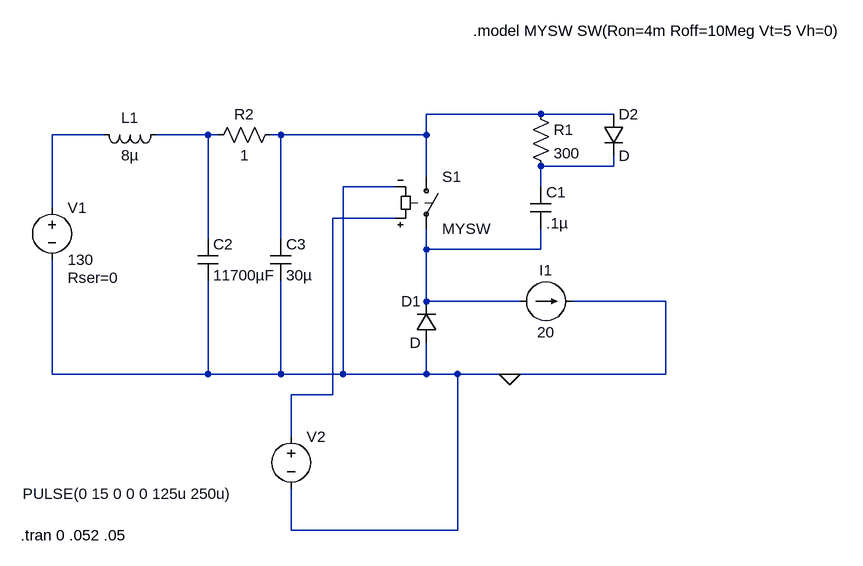
[diagram p0: schematic bus_cap.asc]
bus_cap.asc, the LTspice schematic file:
Version 4
SHEET 1 988 680
WIRE 416 -32 240 -32
WIRE 528 -32 416 -32
WIRE -256 0 -336 0
WIRE -96 0 -176 0
WIRE -80 0 -96 0
WIRE 16 0 0 0
WIRE 240 0 240 -32
WIRE 240 0 16 0
WIRE 528 48 528 32
WIRE 528 48 416 48
WIRE 240 64 240 0
WIRE 192 80 112 80
WIRE 416 80 416 48
WIRE -336 112 -336 0
WIRE 192 128 96 128
WIRE -96 160 -96 0
WIRE 16 160 16 0
WIRE 240 176 240 144
WIRE 416 176 416 144
WIRE 416 176 240 176
WIRE 240 256 240 176
WIRE 384 256 240 256
WIRE 608 256 464 256
WIRE -336 368 -336 192
WIRE -96 368 -96 224
WIRE -96 368 -336 368
WIRE 16 368 16 224
WIRE 16 368 -96 368
WIRE 112 368 112 80
WIRE 112 368 16 368
WIRE 240 368 240 320
WIRE 240 368 112 368
WIRE 288 368 240 368
WIRE 368 368 288 368
WIRE 608 368 608 256
WIRE 608 368 368 368
WIRE 96 400 96 128
WIRE 96 400 32 400
WIRE 32 464 32 400
WIRE 32 608 32 544
WIRE 288 608 288 368
WIRE 288 608 32 608
FLAG 368 368 0
SYMBOL sw 240 48 R0
SYMATTR InstName S1
SYMATTR Value MYSW
SYMBOL cap -112 160 R0
SYMATTR InstName C2
SYMATTR Value 11700µF
SYMATTR SpiceLine Rser=18.3m Lser=.01u
SYMBOL voltage -336 96 R0
WINDOW 123 0 0 Left 2
WINDOW 39 24 124 Left 2
SYMATTR SpiceLine Rser=0
SYMATTR InstName V1
SYMATTR Value 130
SYMBOL voltage 32 448 R0
WINDOW 3 -413 104 Left 2
WINDOW 123 0 0 Left 2
WINDOW 39 0 0 Left 2
SYMATTR Value PULSE(0 15 0 0 0 125u 250u)
SYMATTR InstName V2
SYMBOL ind -160 -16 R90
WINDOW 0 5 56 VBottom 2
WINDOW 3 32 56 VTop 2
SYMATTR InstName L1
SYMATTR Value 8µ
SYMBOL diode 256 320 R180
WINDOW 0 24 64 Left 2
WINDOW 3 24 0 Left 2
SYMATTR InstName D1
SYMBOL current 384 256 R270
WINDOW 0 32 40 VTop 2
WINDOW 3 -32 40 VBottom 2
WINDOW 123 0 0 Left 2
WINDOW 39 0 0 Left 2
SYMATTR InstName I1
SYMATTR Value 20
SYMBOL cap 400 80 R0
SYMATTR InstName C1
SYMATTR Value .1µ
SYMBOL res 400 -48 R0
SYMATTR InstName R1
SYMATTR Value 300
SYMBOL diode 512 -32 R0
SYMATTR InstName D2
SYMBOL cap 0 160 R0
SYMATTR InstName C3
SYMATTR Value 30µ
SYMATTR SpiceLine Rser=.1m Lser=.01u
SYMBOL res 16 -16 R90
WINDOW 0 0 56 VBottom 2
WINDOW 3 32 56 VTop 2
SYMATTR InstName R2
SYMATTR Value 1
TEXT -384 616 Left 2 !.tran 0 .052 .05
TEXT 312 -160 Left 2 !.model MYSW SW(Ron=4m Roff=10Meg Vt=5 Vh=0)

The netlist it stands for:
* bus_cap.asc
S1 N001 N006 N005 0 MYSW
C2 N003 0 11700µF Rser=18.3m Lser=.01u
V1 N002 0 130 Rser=0
V2 N005 0 PULSE(0 15 0 0 0 125u 250u)
L1 N003 N002 8µ
D1 0 N006 D
I1 N006 0 20
C1 N004 N006 .1µ
R1 N001 N004 300
D2 N001 N004 D
C3 N001 0 30µ Rser=.1m Lser=.01u
R2 N001 N003 1
.model D D
.lib standard.dio
.tran 0 .052 .05
.model MYSW SW(Ron=4m Roff=10Meg Vt=5 Vh=0)
.backanno
.end